# Altium schematic sheet Main.SchDoc
size A2; SheetNumber: 1; SheetTotal: 1
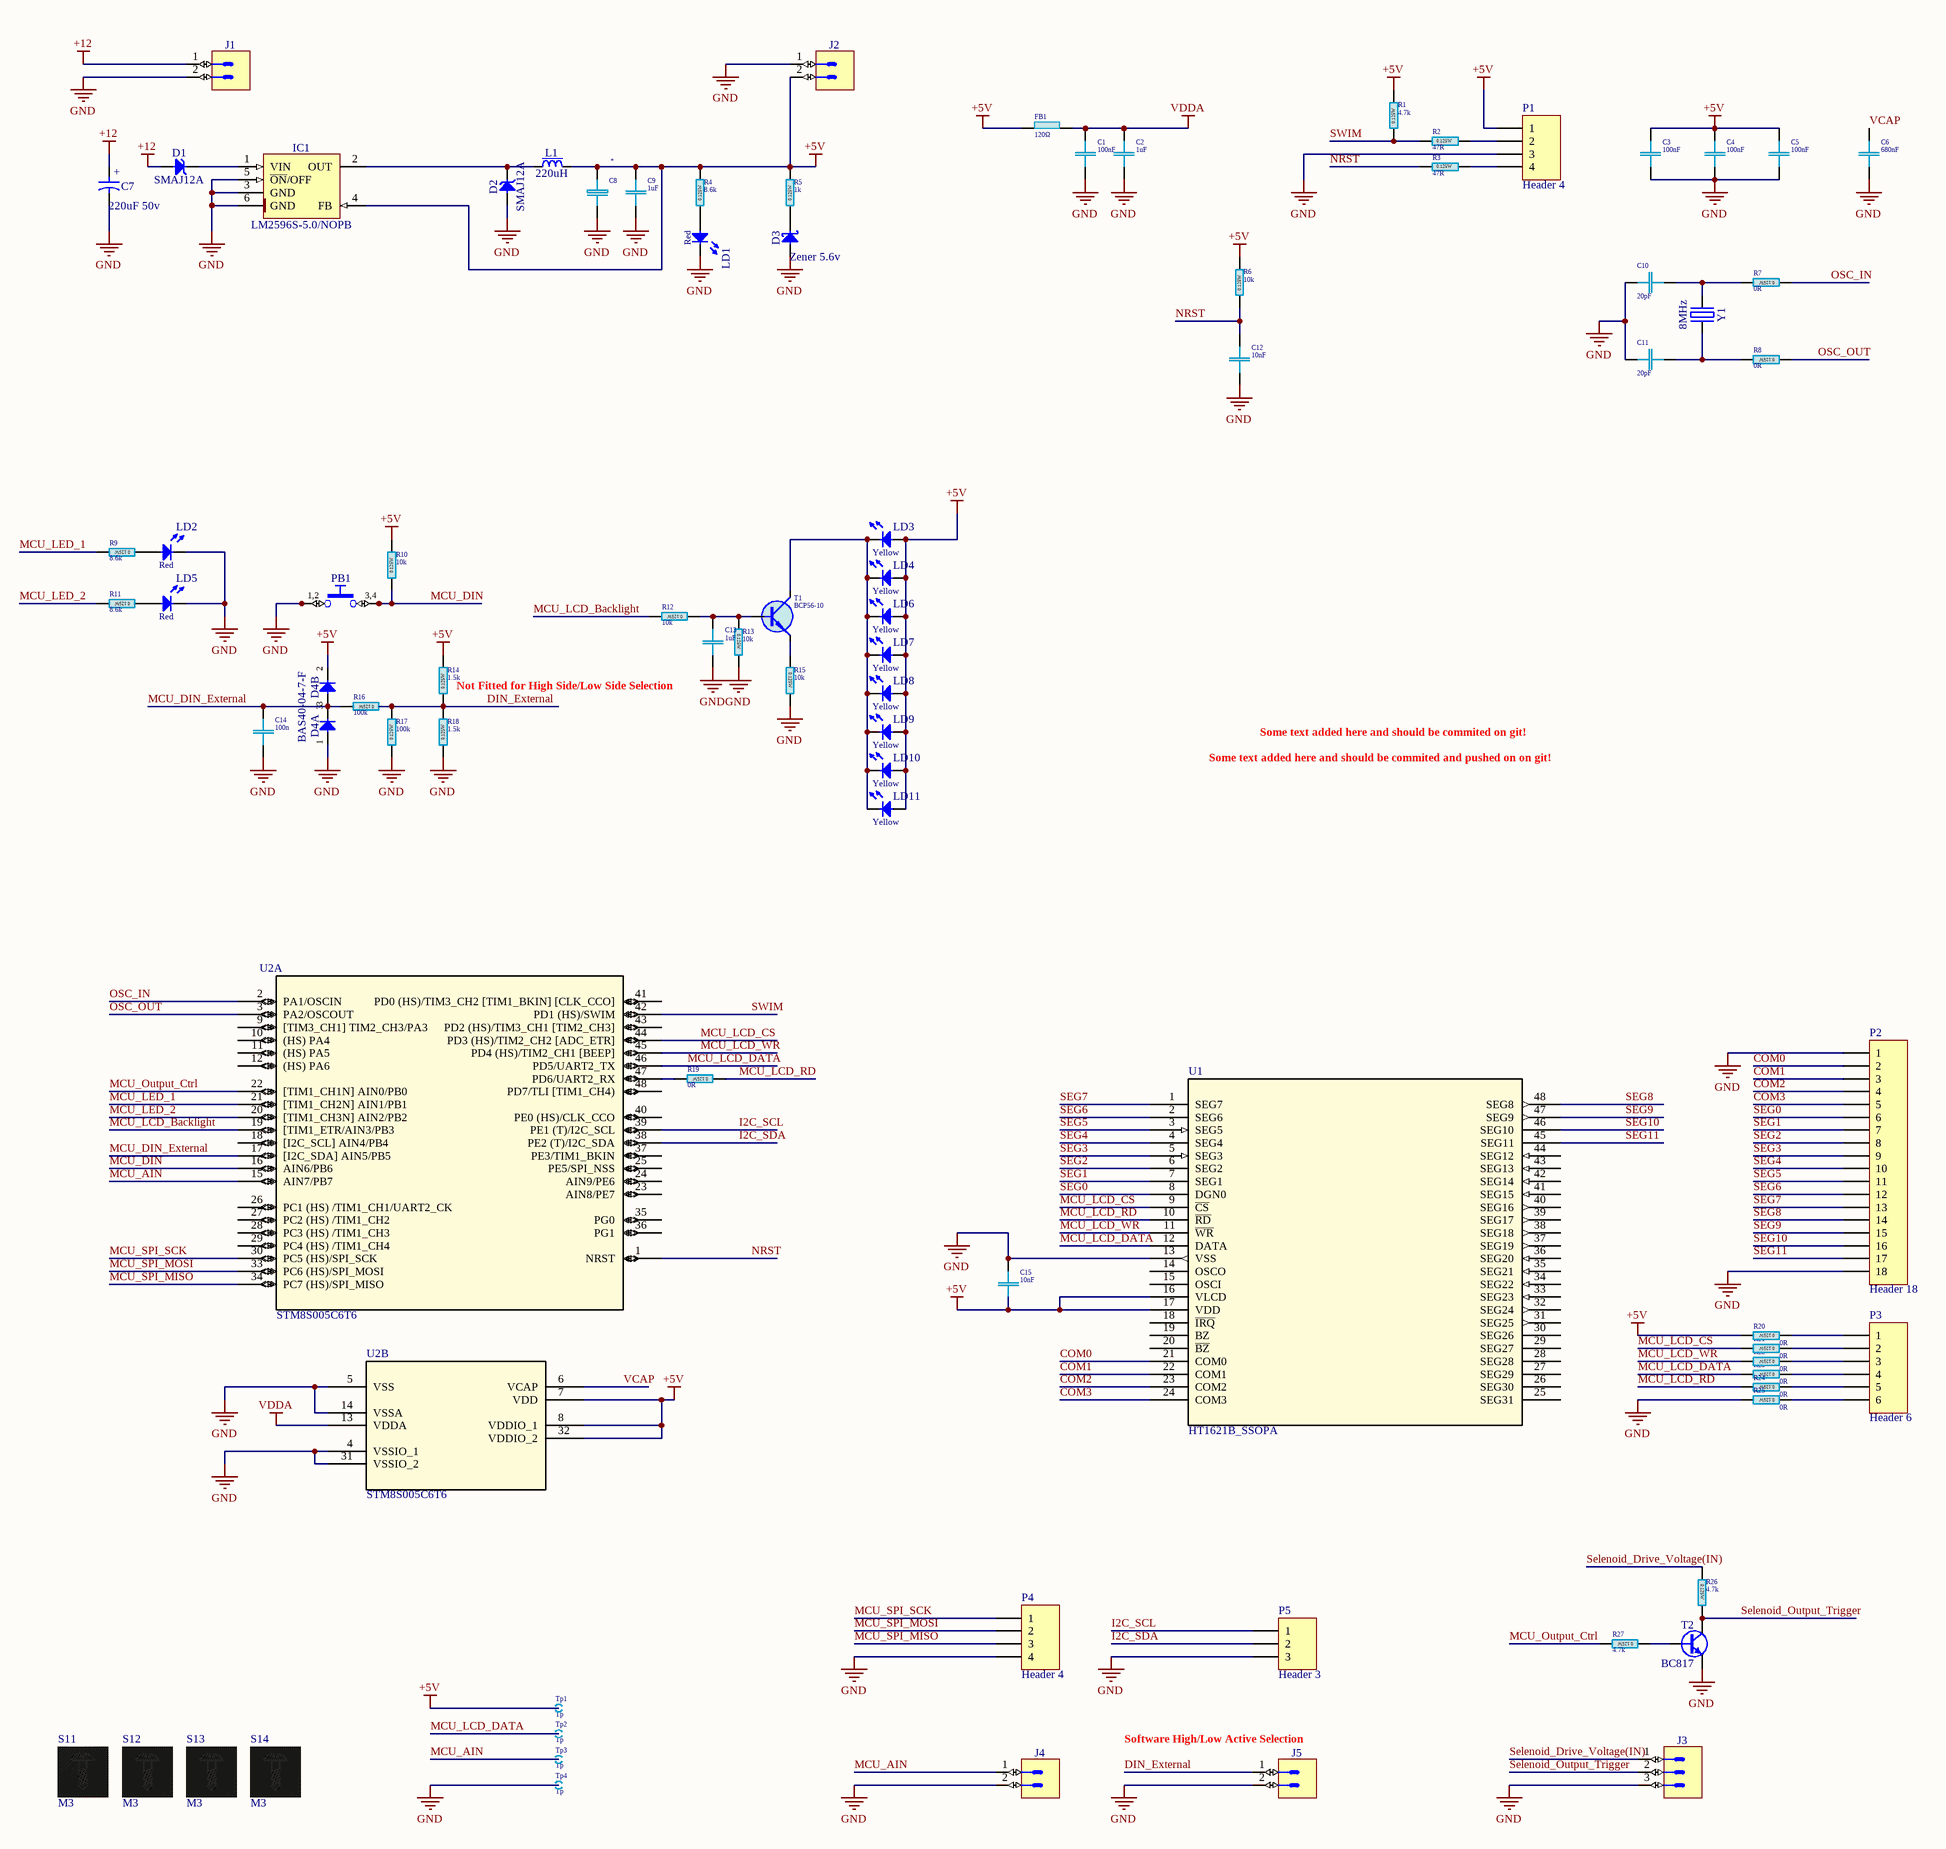
[diagram p0: Main.SchDoc]

## Parts
C1  100nF  [C 0805(2012)x0.65]
C2  1uF  [C 0805(2012)x0.65]
C3  100nF  [C 0805(2012)x0.65]
C4  100nF  [C 0805(2012)x0.65]
C5  100nF  [C 0805(2012)x0.65]
C6  680nF  [C 0805(2012)x0.65]
C7  220uF 50v  [CAPAE1030X1020N]
C8  *  [EL SMD D8 h10.5]
C9  1uF  [C 0805(2012)x0.65]
C10  20pF  [C 0805(2012)x0.65]
C11  20pF  [C 0805(2012)x0.65]
C12  10nF  [C 0805(2012)x0.65]
C13  1uF  [C 0805(2012)x0.65]
C14  100n  [C 0805(2012)x0.65]
C15  10nF  [C 0805(2012)x0.65]
D1  SMAJ12A  [DIOM5127X229N]
D2  SMAJ12A  [DIOM5127X229N]
D3  Zener 5.6v  [DIOMELF3515AN]
D4  BAS40-04-7-F  [SOT95P240X110-3N]  (value not drawn)  (parts A,B of 2)
FB1  ZTyp@100MHz: 120Ω  [FB 0805(2012)]  (hidden comment: 0.525u)
IC1  LM2596S-5.0/NOPB  [TO170P1435X465-6N-R1041X635]
J1  (no value)  [PHOENIX_1803277]
J2  (no value)  [PHOENIX_1803277]
J3  (no value)  [PHOENIX_1803280]
J4  (no value)  [PHOENIX_1803277]
J5  (no value)  [PHOENIX_1803277]
L1  220uH  [IND_MURATA-PS_8200]
LD1  Red  [LED_ROHM_SML-D12U8WT86]
LD2  Red  [LED_ROHM_SML-D12U8WT86]
LD3  Yellow  [LEDM3528X210N_YELLOW]
LD4  Yellow  [LEDM3528X210N_YELLOW]
LD5  Red  [LED_ROHM_SML-D12U8WT86]
LD6  Yellow  [LEDM3528X210N_YELLOW]
LD7  Yellow  [LEDM3528X210N_YELLOW]
LD8  Yellow  [LEDM3528X210N_YELLOW]
LD9  Yellow  [LEDM3528X210N_YELLOW]
LD10  Yellow  [LEDM3528X210N_YELLOW]
LD11  Yellow  [LEDM3528X210N_YELLOW]
P1  Header 4  [HDR1X4]
P2  Header 18  [HDR1X18]
P3  Header 6  [HDR1X6]
P4  Header 4  [HDR1X4]
P5  Header 3  [HDR1X3]
PB1  Push Button  [PB_TYCO_FSM2JSMA]  (value not drawn)
R1  4.7k  [R 0805(2012)]
R2  47R  [R 0805(2012)]
R3  47R  [R 0805(2012)]
R4  8.6k  [R 0805(2012)]
R5  1k  [R 0805(2012)]
R6  10k  [R 0805(2012)]
R7  0R  [R 0805(2012)]
R8  0R  [R 0805(2012)]
R9  8.6k  [R 0805(2012)]
R10  10k  [R 0805(2012)]
R11  8.6k  [R 0805(2012)]
R12  10k  [R 0805(2012)]
R13  10k  [R 0805(2012)]
R14  1.5k  [R 0805(2012)]
R15  10k  [R 0805(2012)]
R16  100k  [R 0805(2012)]
R17  100k  [R 0805(2012)]
R18  1.5k  [R 0805(2012)]
R19  0R  [R 0805(2012)]
R20  0R  [R 0805(2012)]
R21  0R  [R 0805(2012)]
R22  0R  [R 0805(2012)]
R23  0R  [R 0805(2012)]
R24  0R  [R 0805(2012)]
R25  0R  [R 0805(2012)]
R26  4.7k  [R 0805(2012)]
R27  4.7k  [R 0805(2012)]
S11  M3  [PCBComponent_1]
S12  M3  [PCBComponent_1]
S13  M3  [PCBComponent_1]
S14  M3  [PCBComponent_1]
T1  BCP56-10  [SOT223]
T2  BC817  [SOT95P230X110-3N]
Tp1  Tp  [Tp-0.7]  (no BOM)
Tp2  Tp  [Tp-0.7]  (no BOM)
Tp3  Tp  [Tp-0.7]  (no BOM)
Tp4  Tp  [Tp-0.7]  (no BOM)
U1  HT1621B_SSOPA  [DL48]
U2  STM8S005C6T6  [LQFP48-7X7mm]  (parts A,B of 2)
Y1  8MHz  [XTAL1160X490X430]

## Nets
+5V: C3.2 C4.2 C5.2 C8.1 C9.1 C15.2 D4.2(C) FB1.1 IC1.4(FB) J2.2 L1.2 LD3.2(A) LD4.2(A) LD6.2(A) LD7.2(A) LD8.2(A) LD9.2(A) LD10.2(A) LD11.2(A) P1.1 R1.2 R4.2 R5.2 R6.2 R10.2 R14.2 R20.2 Tp1.1 U1.16(VLCD) U1.17(VDD) U2.7(VDD) U2.8(VDDIO_1) U2.32(VDDIO_2)
+12: C7.1 D1.2(A) J1.1
GND: C1.2 C2.2 C3.1 C4.1 C5.1 C6.1 C7.2 C8.2 C9.2 C10.1 C11.1 C12.2 C13.2 C14.2 C15.1 D2.2(A) D3.2(A) D4.1(A) IC1.3(GND) IC1.5(~{ON}/OFF) IC1.6(GND) J1.2 J2.1 J3.3 J4.2 J5.2 LD1.1(C) LD2.1(C) LD5.1(C) P1.3 P2.1 P2.18 P4.4 P5.3 PB1.1 PB1.2 R13.2 R15.2 R17.1 R18.1 R25.2 T2.2(E) Tp4.1 U1.13(VSS) U2.4(VSSIO_1) U2.5(VSS) U2.14(VSSA) U2.31(VSSIO_2)
VDDA: C1.1 C2.1 FB1.2 U2.13(VDDA)
COM0: P2.2 U1.21(COM0)
COM1: P2.3 U1.22(COM1)
COM2: P2.4 U1.23(COM2)
COM3: P2.5 U1.24(COM3)
DIN_External: J5.1 R14.1 R16.1 R17.2 R18.2
I2C_SCL: P5.1 U2.39(PE1_(T)/I2C_SCL)
I2C_SDA: P5.2 U2.38(PE2_(T)/I2C_SDA)
MCU_AIN: J4.1 Tp3.1 U2.15(AIN7/PB7)
MCU_DIN: PB1.3 PB1.4 R10.1 U2.16(AIN6/PB6)
MCU_DIN_External: C14.1 D4.3(COMAC) R16.2 U2.17([I2C_SDA]_AIN5/PB5)
MCU_LCD_Backlight: R12.2 U2.19([TIM1_ETR/AIN3/PB3)
MCU_LCD_CS: R21.2 U1.9(~{CS}) U2.44(PD3_(HS)/TIM2_CH2_[ADC_ETR])
MCU_LCD_DATA: R23.2 Tp2.1 U1.12(DATA) U2.46(PD5/UART2_TX)
MCU_LCD_RD: R19.1 R24.2 U1.10(~{RD})
MCU_LCD_WR: R22.2 U1.11(~{WR}) U2.45(PD4_(HS)/TIM2_CH1_[BEEP])
MCU_LED_1: R9.2 U2.21([TIM1_CH2N]_AIN1/PB1)
MCU_LED_2: R11.2 U2.20([TIM1_CH3N]_AIN2/PB2)
MCU_Output_Ctrl: R27.2 U2.22([TIM1_CH1N]_AIN0/PB0)
MCU_SPI_MISO: P4.3 U2.34(PC7_(HS)/SPI_MISO)
MCU_SPI_MOSI: P4.2 U2.33(PC6_(HS)/SPI_MOSI)
MCU_SPI_SCK: P4.1 U2.30(PC5_(HS)/SPI_SCK)
NRST: C12.1 R3.1 R6.1 U2.1(NRST)
OSC_IN: R7.1 U2.2(PA1/OSCIN)
OSC_OUT: R8.1 U2.3(PA2/OSCOUT)
SEG0: P2.6 U1.8(DGN0)
SEG1: P2.7 U1.7(SEG1)
SEG2: P2.8 U1.6(SEG2)
SEG3: P2.9 U1.5(SEG3)
SEG4: P2.10 U1.4(SEG4)
SEG5: P2.11 U1.3(SEG5)
SEG6: P2.12 U1.2(SEG6)
SEG7: P2.13 U1.1(SEG7)
SEG8: P2.14 U1.48(SEG8)
SEG9: P2.15 U1.47(SEG9)
SEG10: P2.16 U1.46(SEG10)
SEG11: P2.17 U1.45(SEG11)
Selenoid_Drive_Voltage(IN): J3.1 R26.1
Selenoid_Output_Trigger: J3.2 R26.2 T2.3(C)
SWIM: R1.1 R2.1 U2.42(PD1_(HS)/SWIM)
VCAP: C6.2 U2.6(VCAP)
NetC10_2: C10.2 R7.2 Y1.1(OSC1)
NetC11_2: C11.2 R8.2 Y1.2(OSC2)
NetC13_1: C13.1 R12.1 R13.1 T1.1(B)
NetD1_1: D1.1(C) IC1.1(VIN)
NetD2_1: D2.1(C) IC1.2(OUT) L1.1
NetD3_1: D3.1(C) R5.1
NetLD1_2: LD1.2(A) R4.1
NetLD2_2: LD2.2(A) R9.1
NetLD3_1: LD3.1(C) LD4.1(C) LD6.1(C) LD7.1(C) LD8.1(C) LD9.1(C) LD10.1(C) LD11.1(C) T1.2(C)
NetLD5_2: LD5.2(A) R11.1
NetP1_2: P1.2 R2.2
NetP1_4: P1.4 R3.2
NetP3_1: P3.1 R20.1
NetP3_2: P3.2 R21.1
NetP3_3: P3.3 R22.1
NetP3_4: P3.4 R23.1
NetP3_5: P3.5 R24.1
NetP3_6: P3.6 R25.1
NetR15_1: R15.1 T1.3(E)
NetR19_2: R19.2 U2.47(PD6/UART2_RX)
NetR27_1: R27.1 T2.1(B)

Not connected (* = marked no-connect by the designer): U1 14(OSCO) 15(OSCI) 18(~{IRQ}) 19(BZ) 20(~{BZ}) 25(SEG31) 26(SEG30) 27(SEG29) 28(SEG28) 29(SEG27) 30(SEG26) 31(SEG25) 32(SEG24) 33(SEG23) 34(SEG22) 35(SEG21) 36(SEG20) 37(SEG19) 38(SEG18) 39(SEG17) 40(SEG16) 41(SEG15) 42(SEG14) 43(SEG13) 44(SEG12); U2 9([TIM3_CH1]_TIM2_CH3/PA3) 10((HS)_PA4) 11((HS)_PA5) 12((HS)_PA6) 18([I2C_SCL]_AIN4/PB4) 23(AIN8/PE7) 24(AIN9/PE6) 25(PE5/SPI_NSS) 26(PC1_(HS)_/TIM1_CH1/UART2_CK) 27(PC2_(HS)_/TIM1_CH2) 28(PC3_(HS)_/TIM1_CH3) 29(PC4_(HS)_/TIM1_CH4) 35(PG0) 36(PG1) 37(PE3/TIM1_BKIN) 40(PE0_(HS)/CLK_CCO) 41(PD0_(HS)/TIM3_CH2_[TIM1_BKIN]_[CLK_CCO]) 43(PD2_(HS)/TIM3_CH1_[TIM2_CH3]) 48(PD7/TLI_[TIM1_CH4))

## Notes on the sheet
- (near R14) Not Fitted for High Side/Low Side Selection
- Some text added here and should be commited on git!
- Some text added here and should be commited and pushed on on git!
- (near J5) Software High/Low Active Selection
- (in symbol CAE1030-1020_220UF_50V_20%) +
- (in symbol PB_TYCO_FSM2JSMA) 1,2; 3,4

## Library data of the parts
C1 C3-C6 C10-C12 C15 = C 0805    16V X7R - 0*: SMD 0805     16V X7R 10%; Manufacturer: Samsung; TYPE: Capacitors; Package-mm: 2012; Part Number: *; Mount Type: SMT; Publisher: Hefest; Manufacturer Alternate: *; Part Number Alternate: *; Published: 07.04.2019; Supplier 1: Comet; Supplier Part Number 1: *; RoHS: Y; Technology: Ceramic  MLCC; Package: 0805; VDC: 16V; TempCo: X7R; Tolerance %: ±10%; VAC: *; ESR Ohm: *; ComponentLink1Description: Datasheet Link; ComponentLink1URL: https://store.comet.bg/download-file.php?id=11; Temperature Range: -55°C ~ +125°C; Price: *
  C1 C3-C5: Value: 100nF
  C6: Value: 680nF
  C10 C11: Value: 20pF
  C12 C15: Value: 10nF
C2 C9 C13 C14 = C 0805    50V X7R - 1u: SMD 0805     50V X7R 10%; Part Number: CL21B105KBFNNNE; Manufacturer: Samsung; TYPE: Capacitors; Package-mm: 2012; Mount Type: SMT; Publisher: Hefest; Manufacturer Alternate: *; Part Number Alternate: *; Published: 07.04.2019; Supplier 1: Comet; Supplier Part Number 1: C0805 1.0uF 50V X7R SAMSUNG; RoHS: Y; Technology: Ceramic  MLCC; Package: 0805; VDC: 50V; TempCo: X7R; Tolerance %: ±10%; VAC: *; ESR Ohm: *; ComponentLink1Description: Datasheet Link; ComponentLink1URL: https://store.comet.bg/download-file.php?id=11; Temperature Range: -55°C ~ +125°C; Price: 0.17
  C2 C9 C13: Value: 1uF
  C14: Value: 100n
C7 = CAE1030-1020_220UF_50V_20%: Polarised capacitor; Part Description: Aluminum Electrolytic SMT Capacitor; Manufacturer: PANASONIC; Manufacturer Part Number: EEEFK1H221P; Tolerance: ±20%; Part Number: CAE1030-1020_220UF_50V_20%; Component Kind: Standard; Component Type: Standard; Pin Count: 2; Value: 220uF; Status: Not Recommended; Voltage: 50V; Case: G; Mounted: Yes; Socket: No; SMD: Yes; Sense: No; ComponentHeight: 10.2mm; HelpURL: \\cern.ch\dfs\Applications\Altium\Datasheets\CAE_PANASONIC_FK.pdf; Author: CERN DEM JLC; CreateDate: 10/3/2017; LatestRevisionDate: 10/3/2017
C8 = EL D   8mm h10.5mm: SMD D   8mm h10.5mm; Manufacturer: Fujicon; Tolerance %: ±20%; TYPE: Capacitors; Load life: 2000h @ +105°C; Part Number: *; Mount Type: SMT; Publisher: Hefest; Manufacturer Alternate: *; Part Number Alternate: *; Published: 07.04.2019; Supplier 1: Comet; Supplier Part Number 1: *; RoHS: Y; Technology: Electrolytic Aluminum; Package: D8mm h10.5mm; VDC: *; TempCo: *; VAC: *; ESR Ohm: *; ComponentLink1Description: Datasheet Link; ComponentLink1URL: https://store.comet.bg/download-file.php?id=10100; Temperature Range: -40°C ~ +105°C; Price: *; Value: *
D1 D2 = SMAJ12A: Transient Voltage Suppressor Diode (Uni-Directional); Part Description: Surface Mount TRANSZORB® Uni-directional Transient Voltage Suppressors; Manufacturer: VISHAY GENERAL SEMICONDUCTOR; Voltage: 12V; Power: 20.1A; PressFit: No; Bonding: No; Part Number: SMAJ12A; Component Kind: Standard; Component Type: Standard; Device: SMAJ12A; PackageDescription: DO-214-AC Molded Diode, 2-Leads, Body 5.1x2.7mm, IPC Medium Density; Manufacturer Part Number: SMAJ12A; Pin Count: 2; Case: DO-214AC; Mounted: Yes; Socket: No; SMD: Yes; Sense: No; ComponentHeight: 2.29mm; HelpURL: \\cern.ch\dfs\Applications\Altium\Datasheets\SMAJ12A.pdf; Author: CERN DEM JLC; CreateDate: 11/17/2008; LatestRevisionDate: 11/17/2008
D3 = BAS86-M: Zener 5.6V minimelf; Part Description: Small Signal Schottky Diode; Manufacturer: VISHAY SEMICONDUCTORS; Voltage: 50V; Power: 200mA; PressFit: No; Bonding: No; Part Number: BAS86-M; Component Kind: Standard; Component Type: Standard; Device: BAS86-M; PackageDescription: SOD-80, MELF Diode, 2-Leads, Body 3.5x1.5mm, IPC Medium Density; Manufacturer Part Number: BAS86-M; Pin Count: 2; Case: SOD-80; Mounted: Yes; Socket: No; SMD: Yes; Sense: No; ComponentHeight: 1.6mm; HelpURL: \\cern.ch\dfs\Applications\Altium\Datasheets\BAS86-M.pdf; Author: CERN DEM JLC; CreateDate: 7/17/2017; LatestRevisionDate: 7/17/2017
D4 = BAS40-04-7-F: Serial Diode; Part Description: Dual Series Surface Mount Schottky Barrier Diodes; Manufacturer: DIODES INCORPORATED; Voltage: 40V; Power: 200mA; PressFit: No; Bonding: No; Part Number: BAS40-04-7-F; Component Kind: Standard; Component Type: Standard; Device: BAS40-04-7-F; PackageDescription: SOT, 0.95mm Pitch; 3 Pin, 1.30mm W X 2.90mm L X 1.10mm H, IPC Medium Density; Manufacturer Part Number: BAS40-04-7-F; Pin Count: 3; Case: SOT23-3; Mounted: Yes; Socket: No; SMD: Yes; Sense: No; ComponentHeight: 1.1mm; HelpURL: \\cern.ch\dfs\Applications\Altium\Datasheets\BAS40-04-7-F.pdf; Author: CERN DEM JLC; CreateDate: 7/7/2014; LatestRevisionDate: 7/7/2014
FB1 = FB BLM21P 330: SMD 0805 1.5A 330Ω/90mΩ; Part Number: BLM21PG331SN1D; Manufacturer: Murata; TYPE: Ferrite Bead; Ind: 0.525uH; DC Resistance: 90mΩ; Material: Ferrite; Package-mm: 2012; Tolerance %: ±20%; Temperature Range: -55°C ~ +125°C; Imax: 1.5A; Irms: *; Isat: *; Technology: Chip; Published: 07.04.2019; Publisher: Hefest; Mount Type: SMT; Package: 0805; ComponentLink1Description: Datasheet Link; ComponentLink1URL: https://store.comet.bg/download-file.php?id=1453; RoHS: Y; Ztyp@1GHz: *; Manufacturer Alternate: *; Supplier 1: Comet; Supplier Part Number 1: BLM21PG331SN1D; Part Number Alternate: *; Price: 0.032; Value: 0.525u
IC1 = LM2596S-5.0/NOPB: SIMPLE SWITCHER® Power Converter 150kHz, 3A Step-Down Voltage Regulator; Part Description: 4.5V to 40V Input to 5V Output, SIMPLE SWITCHER® Power Converter 150kHz, 3A Step-Down Voltage Regulator; Manufacturer: TEXAS INSTRUMENTS; PressFit: No; Bonding: No; Part Number: LM2596S-5.0/NOPB; Component Kind: Standard; Component Type: Standard; Device: LM2596S-5.0/NOPB; PackageDescription: TO-263, 5 Leads, 1.70mm pitch; TO, 14.35mm L X 8.64mm W X 4.65mm H body IPC Medium Density; Manufacturer Part Number: LM2596S-5.0/NOPB; Pin Count: 6; Case: TO-263; Mounted: Yes; Socket: No; SMD: Yes; Sense: No; ComponentHeight: 4.65mm; HelpURL: \\cern.ch\dfs\Applications\Altium\Datasheets\LM2596S-5.0-NOPB.pdf; Author: CERN DEM JLC; CreateDate: 12/19/2018; LatestRevisionDate: 12/19/2018
J1 J2 J4 J5 = PHOENIX_1803277: Connector 2 Male; Part Description: 8A 160 V, Pitch: 3.81mm, 2 Positions  Right Angled Header; Manufacturer: PHOENIX CONTACT; Manufacturer Part Number: 1803277 (MC 1,5/ 2-G-3,81); PressFit: No; Part Number: PHOENIX_1803277; Component Kind: Standard; Component Type: Standard; Pin Count: 2; Mounted: Yes; Socket: No; SMD: No; Sense: No; Status: None; ComponentHeight: 7.25mm; HelpURL: \\cern.ch\dfs\Applications\Altium\Datasheets\PHOENIX_1803277.pdf; Author: CERN DEM JLC; CreateDate: 5/6/2014; LatestRevisionDate: 5/6/2014
J3 = PHOENIX_1803280: Connector 3 Male; Part Description: 8A 160 V, Pitch: 3.81mm, 3 Positions  Right Angled Header; Manufacturer: PHOENIX CONTACT; Manufacturer Part Number: 1803277 (MC 1,5/ 3-G-3,81); PressFit: No; Part Number: PHOENIX_1803280; Component Kind: Standard; Component Type: Standard; Pin Count: 3; Mounted: Yes; Socket: No; SMD: No; Sense: No; Status: None; ComponentHeight: 7.25mm; HelpURL: \\cern.ch\dfs\Applications\Altium\Datasheets\PHOENIX_1803280.pdf; Author: CERN DEM BC; CreateDate: 9/23/2019; LatestRevisionDate: 9/23/2019
L1 = IND_220UH_10%_MURATA-PS_8200: Inductor With Core; Part Description: Miniature Surface Mount Power Inductor (8200 Series); Manufacturer: MURATA POWER SOLUTIONS; Manufacturer Part Number: 82224C; Power: 100mA; Resistance: 8R; Tolerance: ±10%; Part Number: IND_220UH_10%_MURATA-PS_8200; Component Kind: Standard; Component Type: Standard; Pin Count: 2; Value: 220uH; Status: None; Mounted: Yes; Socket: No; SMD: Yes; Sense: No; ComponentHeight: 2.3mm; HelpURL: \\cern.ch\dfs\Applications\Altium\Datasheets\IND_MURATA-PS_8200.pdf; Author: CERN DEM JMW; CreateDate: 10/7/2015; LatestRevisionDate: 10/7/2015
LD1 LD2 LD5 = LED_ROHM_SML-D12U8WT86: LED Red 1C 2A; Part Description: High Brightness and High Reliability Chip 0603(1608mm) Red LED SML-D12x8 Series; Manufacturer: ROHM; PressFit: No; Bonding: No; Part Number: LED_ROHM_SML-D12U8WT86; Component Kind: Standard; Component Type: Standard; Color: Red; PackageDescription: Red Chip LED, 2-Leads, Body 1.6x0.8mm (0603), SML-D12x8 Series; Manufacturer Part Number: SML-D12U8WT86; Pin Count: 2; Mounted: Yes; Socket: No; SMD: Yes; Sense: No; ComponentHeight: 0.55mm; HelpURL: \\cern.ch\dfs\Applications\Altium\Datasheets\LED_ROHM_SML-D12U8WT86.pdf; Author: CERN DEM JLC; CreateDate: 10/23/2017; LatestRevisionDate: 10/23/2017
LD3 LD4 LD6-LD11 = LED_OSRAM_LYT676-R1S2-26: LED Yellow 1C 2A; Part Description: Hyper TOPLED® SMD Yellow LED; Manufacturer: OSRAM; PressFit: No; Bonding: No; Part Number: LED_OSRAM_LYT676-R1S2-26; Component Kind: Standard; Component Type: Standard; Color: Yellow; PackageDescription: Molded LED, 2-Leads, Body 3.5x2.8mm, IPC Medium Density PCB Edge Mounting; Manufacturer Part Number: LY T676-R1S2-26; Pin Count: 2; Mounted: Yes; Socket: No; SMD: Yes; Sense: No; ComponentHeight: 1.2mm; HelpURL: \\cern.ch\dfs\Applications\Altium\Datasheets\LED_OSRAM_LYT676-R1S2-26.pdf; Author: CERN DEM JLC; CreateDate: 5/14/2008; LatestRevisionDate: 3/17/2010
P1 P4 = Header 4: Header, 4-Pin; LatestRevisionDate: 17-Jul-2002; LatestRevisionNote: Re-released for DXP Platform.; Publisher: Altium Limited
P2 = Header 18: Header, 18-Pin; LatestRevisionDate: 17-Jul-2002; LatestRevisionNote: Re-released for DXP Platform.; Publisher: Altium Limited
P3 = Header 6: Header, 6-Pin; LatestRevisionDate: 17-Jul-2002; LatestRevisionNote: Re-released for DXP Platform.; Publisher: Altium Limited
P5 = Header 3: Header, 3-Pin; LatestRevisionDate: 17-Jul-2002; LatestRevisionNote: Re-released for DXP Platform.; Publisher: Altium Limited
PB1 = PB_TYCO_FSM2JSMA: Push-Button Switch SPDT; Part Description: 12VDC 50mA SPST Tactile  Push-Button Switch; Manufacturer: TYCO ELECTRONICS; Manufacturer Part Number: FSM2JSMA or  2-1437565-7; PressFit: No; Part Number: PB_TYCO_FSM2JSMA; Component Kind: Standard; Component Type: Standard; Pin Count: 4; PackageDescription: Body 6mm x 6mm, Surface Mount Tactile Switches, TYCO ALCOSWITCH FSMJSMA Series; Family: Push Button; Mounted: Yes; Socket: No; SMD: Yes; Sense: No; Status: None; ComponentHeight: 4.59mm; HelpURL: \\cern.ch\dfs\Applications\Altium\Datasheets\PB_TYCO_FSM2JSMA.pdf; Author: CERN DEM JLC; CreateDate: 9/8/2008; LatestRevisionDate: 6/21/2012
R1-R27 = R 0805-5%: SMD 0805 0.125W 5% 150V; Manufacturer: YAGEO; TempCo: ±100ppm/°C; Package-mm: 2012; Value Code: 102; Part Number: *; Mount Type: SMT; Publisher: Hefest; Manufacturer Alternate: *; Published: 07.04.2019; Supplier 1: Comet; Supplier Part Number 1: R0805 1.0K 5% YAG; RoHS: Y; Technology: Thick film; Package: 0805; VDC: 150V; Tolerance %: ±5%; ComponentLink1Description: Datasheet Link; ComponentLink1URL: https://store.comet.bg/download-file.php?id=140; Temperature Range: -55°C ~ +155°C; Price: 0.029; Part Number Alternate: *; TYPE: Resistor; Power: 0.125W
  R1 R26 R27: Value: 4.7k
  R2 R3: Value: 47R
  R4 R9 R11: Value: 8.6k
  R5: Value: 1k
  R6 R10 R12 R13 R15: Value: 10k
  R7 R8 R19-R25: Value: 0R
  R14 R18: Value: 1.5k
  R16 R17: Value: 100k
S11-S14 = Screw
T1 = BCP56-10: SOT89    80V 1A 180MHz   6pF; Part Number: BCP5610TA; Manufacturer: ROHm; TYPE: Transistors; Power: 0.5W; Complementary: BCP53-10; h21e: 63-160; Mount Type: SMT; Publisher: Hefest; Manufacturer Alternate: *; Published: 28.09.2019; Supplier 1: Comet; Supplier Part Number 1: BCP56-10; RoHS: Y; Technology: npn; Package: SOT223; Vce: 80V; Ic: 1A; ComponentLink1Description: Datasheet Link; ComponentLink1URL: https://store.comet.bg/download-file.php?id=15852; Price: 0.20; Part Number Alternate: *; Ft: 180MHz; Value: BCP56-10
T2 = BC817: NPN Transistor; Part Description: 45V 500mA NPN General-Purpose Transistor; Manufacturer: NXP SEMICONDUCTORS; PressFit: No; Bonding: No; Part Number: BC817; Component Kind: Standard; Component Type: Standard; Device: BC817; PackageDescription: SOT23, 3 pin, Pitch 0.95mm - 1.3mm W X 2.9mm L X 1.1mm H, IPC Medium Density; Manufacturer Part Number: BC817; Pin Count: 3; Case: SOT23-3; Mounted: Yes; Socket: No; SMD: Yes; Sense: No; ComponentHeight: 1.1mm; HelpURL: \\cern.ch\dfs\Applications\Altium\Datasheets\BC817.pdf; Author: CERN DEM JLC; CreateDate: 5/12/2011; LatestRevisionDate: 5/12/2011
Tp1-Tp4 = Tp: TestPoint; TYPE: TestPoint; Technology: PCB; Mount Type: SMT; Package: TestPoint; Published: 07.04.2019; Publisher: Hefest; Value: Tp
U1 = DAC7634E: No Description Available; Mfr_Name: Texas Instruments; Copyright: Copyright (C) 2022 Ultra Librarian. All rights reserved.; Manufacturer_Part_Number: DAC7634E; RefDes: RefDes; Type: DEV
U2 = STM8S005C6T6: No Description Available; Mfr_Name: STMicroelectronics; Copyright: Copyright (C) 2022 Ultra Librarian. All rights reserved.; Manufacturer_Part_Number: STM8S005C6T6; RefDes: RefDes; Type: Type
Y1 = XTAL_10MHZ_IQD_LFXTAL003166: Quartz Crystal; Part Description: Tolerance:± 30ppm, Stability:± 50ppm, -10°C to +60°C, 16pF, Surface Mount Quartz Crystal, HC49/4HSMX Series; Manufacturer: IQD FREQUENCY PRODUCTS; Value: 10MHz; PressFit: No; Bonding: No; Part Number: XTAL_10MHZ_IQD_LFXTAL003166; Component Kind: Standard; Component Type: Standard; PackageDescription: HC49/4H SMX Case, SMD Cristal, Body 11.6x4.9mm; Manufacturer Part Number: LF XTAL003166; Pin Count: 2; Mounted: Yes; Socket: No; SMD: Yes; Sense: No; ComponentHeight: 4.3mm; HelpURL: \\cern.ch\dfs\Applications\Altium\Datasheets\XTAL_IQD_LFXTAL003166.pdf; Author: CERN DEM JLC; CreateDate: 4/19/2012; LatestRevisionDate: 11/7/2016